# EAGLE schematic snarfbasev4a (EAGLE 6.4)
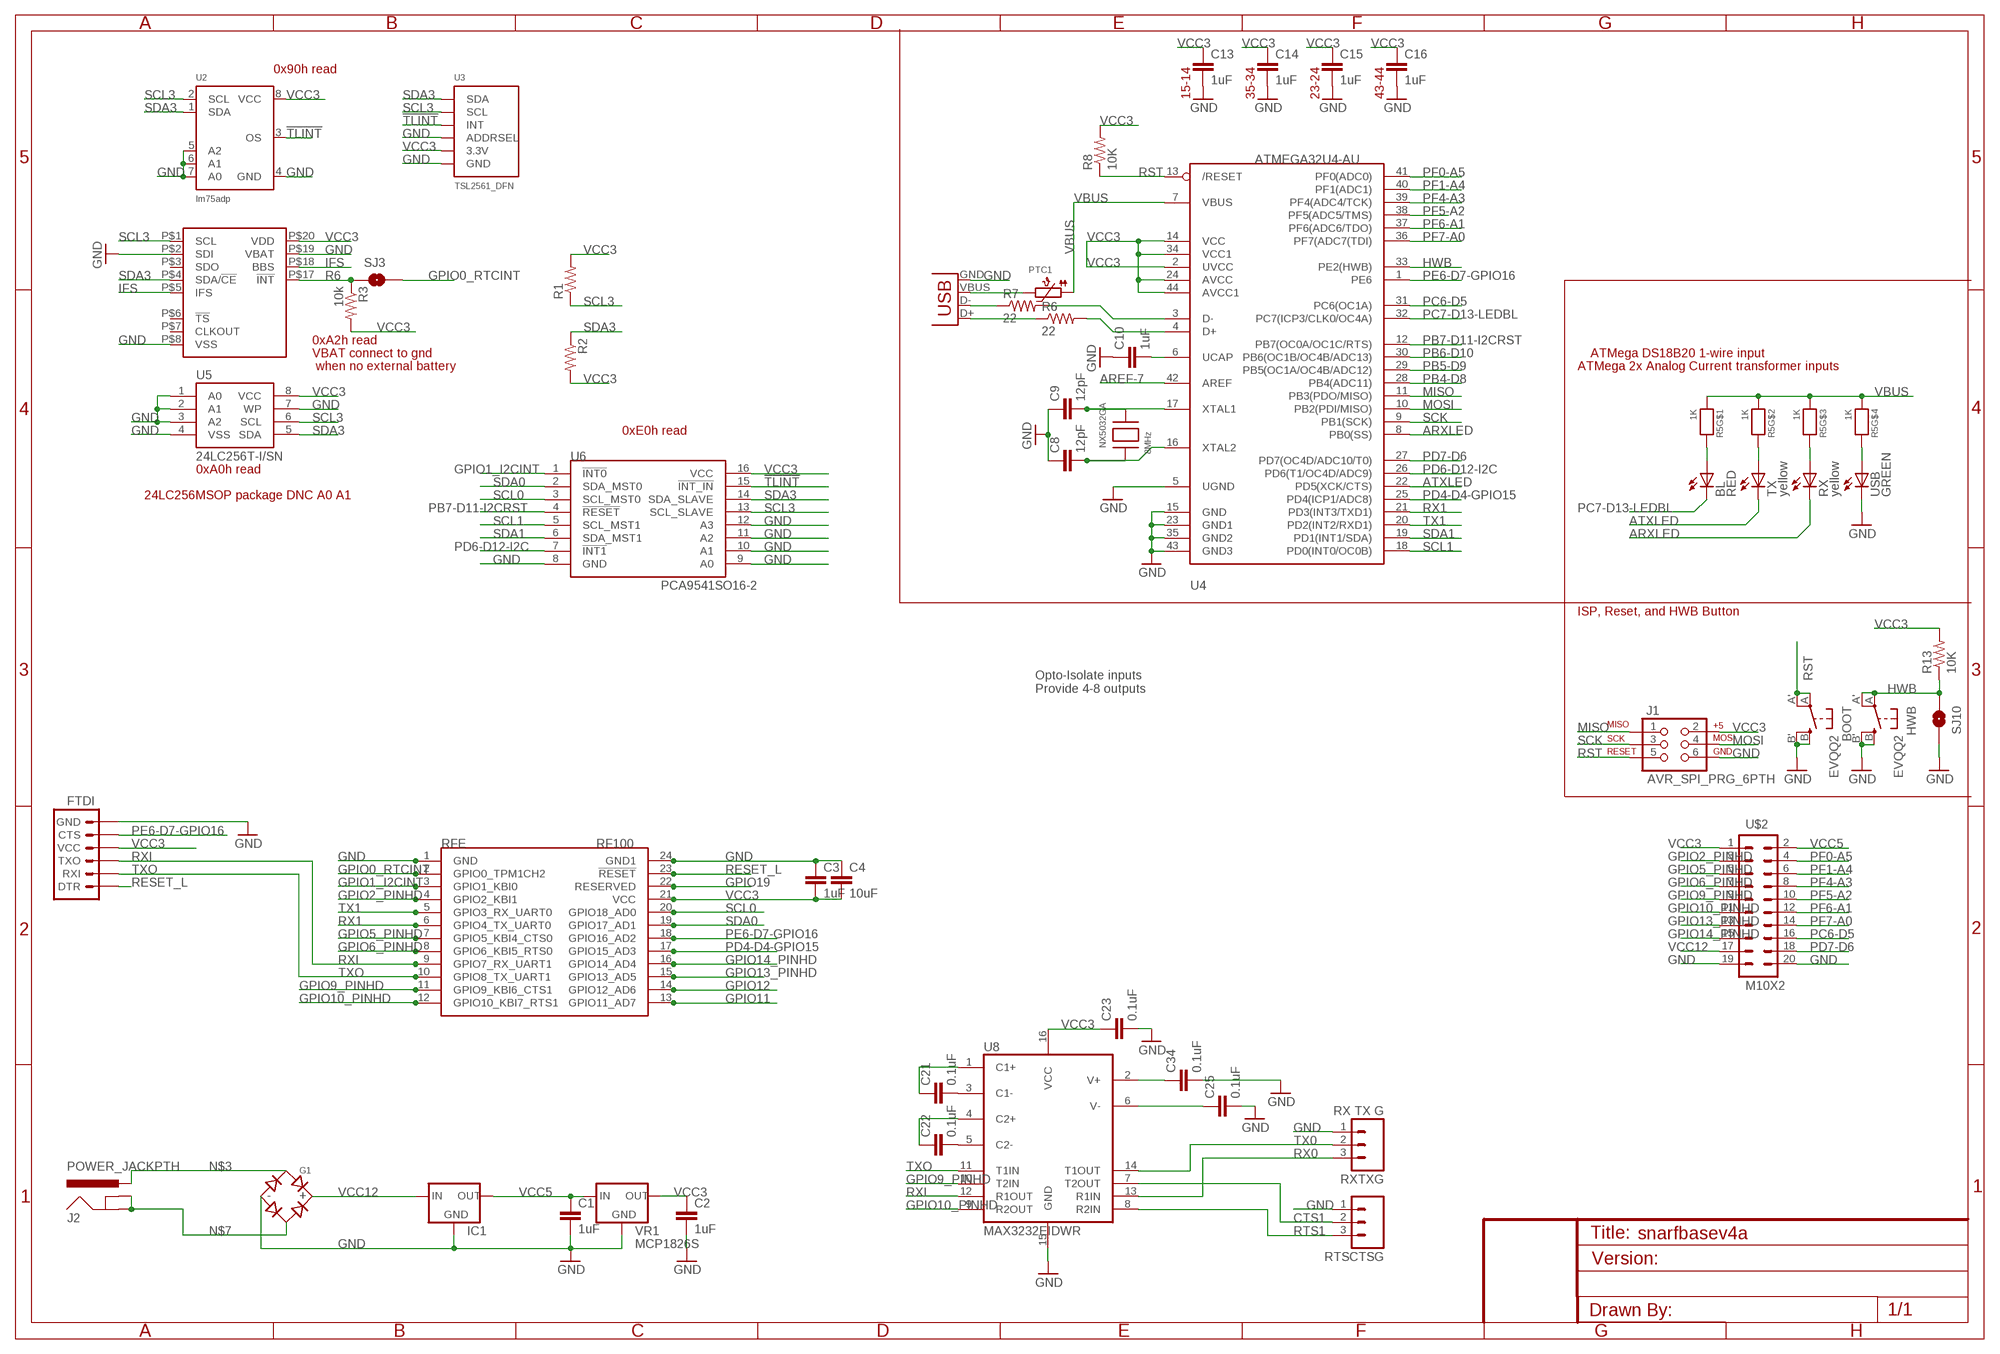
[diagram p0: schematic, sheet 1]

## Parts
BL  RED  LED0603  [LED-0603]
BOOT  EVQQ2  [EVQ-Q2]
C1  1uF  CAP0805  [0805]
C2  1uF  CAP0805  [0805]
C3  1uF  CAP0805  [0805]
C4  10uF  CAP0805  [0805]
C8  12pF  CAP0603-CAP  [0603-CAP]
C9  12pF  CAP0603-CAP  [0603-CAP]
C10  1uF  CAP0805  [0805]
C13  1uF  CAP0805  [0805]
C14  1uF  CAP0805  [0805]
C15  1uF  CAP0805  [0805]
C16  1uF  CAP0805  [0805]
C21  0.1uF  CAP0805  [0805]
C22  0.1uF  CAP0805  [0805]
C23  0.1uF  CAP0805  [0805]
C25  0.1uF  CAP0805  [0805]
C34  0.1uF  CAP0805  [0805]
FTDI  ARDUINO_SERIAL_PROGRAMPTH  [1X06]
G1  BRIDGERECTIFIER  [SOIC-4]
HWB  EVQQ2  [EVQ-Q2]
IC1  V_REG_78XXMURATA  [TO220-MURATA]
J1  AVR_SPI_PRG_6PTH  [2X3]
J2  POWER_JACKPTH  [POWER_JACK_PTH]
NX5032GA  8MHz  XTALNX5032  [NX5032]
PTC1  PTC1206  [1206]
R1  RESISTOR0805-RES  [0805]
R2  RESISTOR0805-RES  [0805]
R3  10k  RESISTOR  [0805]
R5  1K  RESISTOR_4PACK  [RESPACK_4X0603]
R6  22  RESISTOR0603-RES  [0603-RES]
R7  22  RESISTOR0603-RES  [0603-RES]
R8  10K  RESISTOR0805-RES  [0805]
R13  10K  RESISTOR0805-RES  [0805]
RFE  RFE  RF100-JACKJACK2  [SYNAPSERFENGINE-THM-SMT-JACK2]
RTSCTSG  M03PTH  [1X03]
RX  yellow  LED0603  [LED-0603]
RXTXG  RX TX G  M03PTH  [1X03]
SJ3  SOLDERJUMPERNC2  [SJ_2S-NOTRACE]
SJ10  HWB  SOLDERJUMPERNO  [SJ_2S-NO]
TX  yellow  LED0603  [LED-0603]
U1  PCF2129ASO20  [SO20W]
U2  lm75adp  TEMP_LM75B  [TSSOP8]
U3  TSL2561_DFN  LIGHT_TSL2561  [TSL2561_FN]
U4  ATMEGA32U4-AU  [TQFP44]
U5  24LC256T-I/SN  EEPROM-I2CSMD  [SO08]
U6  PCA9541SO16-2  [SOIC16]
U8  MAX3232EIDWR  MAX232SOIC16  [SO016]
U$2  M10X2  [2X10]
USB  GREEN  LED0603  [LED-0603]
VR1  MCP1826S  V_REG_MIC2920  [SOT223]
X1  USBSMD  USBH2959CT-ND  [USB-MINIB]

## Nets
!TLINT: U2.3(OS) U3.INT U6.15(!INT_IN)
AREF-7: U4.42(AREF)
ARXLED [smallsignal]: RX.C U4.8(PB0(SS))
ATXLED [smallsignal]: TX.C U4.22(PD5(XCK/CTS))
CTS1 [smallsignal]: RTSCTSG.2 U8.7(T2OUT)
GND: BOOT.B'(S1) BOOT.B(S) C1.2 C2.2 C3.1 C4.1 C8.1 C9.1 C10.1 C13.2 C14.2 C15.2 C16.2 C23.2 C25.2 C34.2 FTDI.6(GND) G1.- HWB.B'(S1) HWB.B(S) IC1.GND J1.6 RFE.1(GND) RFE.24(GND1) RFE.P1 RFE.P24 RFE.P201 RFE.P224 RTSCTSG.1 RXTXG.1 SJ10.2 U1.P$2(SDI) U1.P$8(VSS) U1.P$19(VBAT) U2.4(GND) U2.5(A2) U2.6(A1) U2.7(A0) U3.ADR(ADDRSEL) U3.VSS(GND) U4.5(UGND) U4.15(GND) U4.23(GND1) U4.35(GND2) U4.43(GND3) U5.1(A0) U5.2(A1) U5.3(A2) U5.4(VSS) U5.7(WP) U6.8(GND) U6.9(A0) U6.10(A1) U6.11(A2) U6.12(A3) U8.15(GND) U$2.19 U$2.20 USB.C VR1.2(GND) VR1.4(GND) X1.GND
GPIO0_RTCINT [smallsignal]: RFE.2(GPIO0_TPM1CH2) RFE.P2 RFE.P202 SJ3.2
GPIO1_I2CINT [smallsignal]: RFE.3(GPIO1_KBI0) RFE.P3 RFE.P203 U6.1(!INT0)
GPIO2_PINHD [smallsignal]: RFE.4(GPIO2_KBI1) RFE.P4 RFE.P204 U$2.3
GPIO5_PINHD [smallsignal]: RFE.7(GPIO5_KBI4_CTS0) RFE.P7 RFE.P207 U$2.5
GPIO6_PINHD [smallsignal]: RFE.8(GPIO6_KBI5_RTS0) RFE.P8 RFE.P208 U$2.7
GPIO9_PINHD: RFE.11(GPIO9_KBI6_CTS1) RFE.P11 RFE.P211 U8.10(T2IN) U$2.9
GPIO10_PINHD: RFE.12(GPIO10_KBI7_RTS1) RFE.P12 RFE.P212 U8.9(R2OUT) U$2.11
GPIO11 [smallsignal]: RFE.13(GPIO11_AD7) RFE.P13 RFE.P213
GPIO12 [smallsignal]: RFE.14(GPIO12_AD6) RFE.P14 RFE.P214
GPIO13_PINHD [smallsignal]: RFE.15(GPIO13_AD5) RFE.P15 RFE.P215 U$2.13
GPIO14_PINHD [smallsignal]: RFE.16(GPIO14_AD4) RFE.P16 RFE.P216 U$2.15
GPIO19: RFE.22(RESERVED) RFE.P22 RFE.P222
HWB [smallsignal]: HWB.A'(P1) HWB.A(P) R13.1 SJ10.1 U4.33(PE2(HWB))
IFS: U1.P$5(IFS) U1.P$18(BBS)
MISO [smallsignal]: J1.1 U4.11(PB3(PDO/MISO))
MOSI [smallsignal]: J1.4 U4.10(PB2(PDI/MISO))
N$3 [Power]: G1.~1(AC1) J2.PWR
N$4: C10.2 U4.6(UCAP)
N$5: BL.A R5.8
N$7 [Power]: G1.~2(AC2) J2.GND J2.GNDBREAK
N$8: R5.7 TX.A
N$9: R5.6 RX.A
N$10: R5.5 USB.A
N$13: C21.2 U8.3(C1-)
N$14: C22.2 U8.5(C2-)
N$15: C34.1 U8.2(V+)
N$16: C25.1 U8.6(V-)
N$17: C21.1 U8.1(C1+)
N$18: C22.1 U8.4(C2+)
PB4-D8 [smallsignal]: U4.28(PB4(ADC11))
PB5-D9 [smallsignal]: U4.29(PB5(OC1A/OC4B/ADC12))
PB6-D10 [smallsignal]: U4.30(PB6(OC1B/OC4B/ADC13))
PB7-D11-I2CRST [smallsignal]: U4.12(PB7(OC0A/OC1C/RTS)) U6.4(!RESET)
PC6-D5 [smallsignal]: U4.31(PC6(OC1A)) U$2.16
PC7-D13-LEDBL [smallsignal]: BL.C U4.32(PC7(ICP3/CLK0/OC4A))
PD4-D4-GPIO15 [smallsignal]: RFE.17(GPIO15_AD3) RFE.P17 RFE.P217 U4.25(PD4(ICP1/ADC8))
PD6-D12-I2C [smallsignal]: U4.26(PD6(T1/OC4D/ADC9)) U6.7(!INT1)
PD7-D6 [smallsignal]: U4.27(PD7(OC4D/ADC10/T0)) U$2.18
PE6-D7-GPIO16 [smallsignal]: FTDI.5(CTS) RFE.18(GPIO16_AD2) RFE.P18 RFE.P218 U4.1(PE6)
PF0-A5 [smallsignal]: U4.41(PF0(ADC0)) U$2.4
PF1-A4 [smallsignal]: U4.40(PF1(ADC1)) U$2.6
PF4-A3 [smallsignal]: U4.39(PF4(ADC4/TCK)) U$2.8
PF5-A2 [smallsignal]: U4.38(PF5(ADC5/TMS)) U$2.10
PF6-A1 [smallsignal]: U4.37(PF6(ADC6/TDO)) U$2.12
PF7-A0 [smallsignal]: U4.36(PF7(ADC7(TDI)) U$2.14
R6: R3.1 SJ3.1 U1.P$17(!INT)
RESET_L [smallsignal]: FTDI.1(DTR) RFE.23(!RESET) RFE.P23 RFE.P223
RST [smallsignal]: BOOT.A'(P1) BOOT.A(P) J1.5 R8.1 U4.13(/RESET)
RTS1 [smallsignal]: RTSCTSG.3 U8.8(R2IN)
RX0: RXTXG.3 U8.13(R1IN)
RX1 [smallsignal]: RFE.6(GPIO4_TX_UART0) RFE.P6 RFE.P206 U4.21(PD3(INT3/TXD1))
RXI [smallsignal]: FTDI.3(TXO) RFE.9(GPIO7_RX_UART1) RFE.P9 RFE.P209 U8.12(R1OUT)
SCK [smallsignal]: J1.3 U4.9(PB1(SCK))
SCL0: RFE.20(GPIO18_AD0) RFE.P20 RFE.P220 U6.3(SCL_MST0)
SCL1 [smallsignal]: U4.18(PD0(INT0/OC0B)) U6.5(SCL_MST1)
SCL3 [smallsignal]: R1.1 U1.P$1(SCL) U2.2(SCL) U3.CLK(SCL) U5.6(SCL) U6.13(SCL_SLAVE)
SDA0: RFE.19(GPIO17_AD1) RFE.P19 RFE.P219 U6.2(SDA_MST0)
SDA1 [smallsignal]: U4.19(PD1(INT1/SDA)) U6.6(SDA_MST1)
SDA3 [smallsignal]: R2.1 U1.P$4(SDA/!CE) U2.1(SDA) U3.DATA(SDA) U5.5(SDA) U6.14(SDA_SLAVE)
TX0: RXTXG.2 U8.14(T1OUT)
TX1 [smallsignal]: RFE.5(GPIO3_RX_UART0) RFE.P5 RFE.P205 U4.20(PD2(INT2/RXD1))
TXO [smallsignal]: FTDI.2(RXI) RFE.10(GPIO8_TX_UART1) RFE.P10 RFE.P210 U8.11(T1IN)
UD_N: R7.2 U4.3(D-)
UD_P: R6.2 U4.4(D+)
UDM_N: R7.1 X1.D-
UDM_P: R6.1 X1.D+
VBUS: PTC1.1 R5.1 R5.2 R5.3 R5.4 U4.7(VBUS)
VBUSRAW: PTC1.2 X1.VBUS
VCC3: C2.1 C3.2 C4.2 C13.1 C14.1 C15.1 C16.1 C23.1 FTDI.4(VCC) J1.2 R1.2 R2.2 R3.2 R8.2 R13.2 RFE.21(VCC) RFE.P21 RFE.P221 U1.P$20(VDD) U2.8(VCC) U3.VDD(3.3V) U4.2(UVCC) U4.14(VCC) U4.24(AVCC) U4.34(VCC1) U4.44(AVCC1) U5.8(VCC) U6.16(VCC) U8.16(VCC) U$2.1 VR1.3(OUT)
VCC5 [Power]: C1.1 IC1.OUT U$2.2 VR1.1(IN)
VCC12 [Power]: G1.+ IC1.IN U$2.17
XTAL_N [smallsignal]: C9.2 NX5032GA.P$2 U4.17(XTAL1)
XTAL_P [smallsignal]: C8.2 NX5032GA.P$1 U4.16(XTAL2)
Unconnected: U1.P$3(SDO) U1.P$6(!TS) U1.P$7(CLKOUT)

## Notes on the sheet
- 0x90h read
- 15-14 | 35-34 | 23-24 | 43-44
- 0xA2h read
- VBAT connect to gnd | ATMega DS18B20 1-wire input
- when no external battery | ATMega 2x Analog Current transformer inputs
- 0xE0h read
- 0xA0h read
- 24LC256MSOP package DNC A0 A1
- ISP, Reset, and HWB Button
- Opto-Isolate inputs
  Provide 4-8 outputs

## Library data of the parts
BL RX TX USB = 0_jc-custom:LED: LEDs Standard schematic elements and footprints for 5mm, 3mm, 1206, and 0603 sized LEDs. 5mm - Spark Fun Electronics SKU : COM-00529 (and others)
BOOT HWB = adaprog:EVQQ2
C1-C4 C10 C13-C16 C21-C23 C25 C34 = 0_jc-custom:CAP: Capacitor Standard 0603 ceramic capacitor, and 0.1" leaded capacitor.
C8 C9 = SparkFun:CAP: Capacitor Standard 0603 ceramic capacitor, and 0.1" leaded capacitor.
FTDI = SparkFun:ARDUINO_SERIAL_PROGRAM
G1 = microbuilder:BRIDGERECTIFIER: Bridge Rectifier SOIC-4: Comchip B4S-G - 400V 800mA, Peak Vf 1.1V (Digikey: 641-1334-1-ND)
IC1 = 0_jc-custom-eagle6:V_REG_78XX: Voltage Regulator Standard 7805 5V regulator. IGO (Input Ground Output). Spark Fun Electronics SKU : COM-00107
J1 = SparkFun:AVR_SPI_PRG_6: AVR ISP 6 Pin This is the reduced ISP connector for AVR programming. Common on Arduino. This footprint will take up less PCB space and can be used with a 10-pin to 6-pin adapter such as SKU: BOB-08508
J2 = SparkFun-Connectors:POWER_JACK: Power Jack This is the standard 5.5mm barrel jack for power. The PTH is the most common, proven, reliable, footprint. The Slot footprint only works if the mill layer is transmitted to the PCB fab house so be warned. Mating wall wart : TOL-00298 (and others); PROD_ID: PRT-00119
NX5032GA = adafruit:XTAL: Low cost SMT crystals, no capacitors included http://www.ladyada.net/library/eagle
PTC1 = microbuilder:PTC: PTC (Resettable Fuse) 1206 Package 250mA PTC (16V Max, Time-to-Trip: 0.08s) - Digikey: F2110CT-ND 1210 Package 100mA PTC (30V Max, Time-to-Trip: 0.6s) - Digikey: MF-USMF010-2CT-ND 1812 Package 750mA PTC (24V Max, Time-to-Trip: 0.2s) - Digikey: MF-MSMF075/24-2CT-ND
R1 R2 R8 R13 = SparkFun-Resistors:RESISTOR: Resistor
R3 = SparkFun:RESISTOR: Resistor
R5 = microbuilder:RESISTOR_4PACK: Resistor Packs (4 resistors) 4 x 0603 10K 1/16W - Digikey: YC164J-10KCT-ND
R6 R7 = 0_jc-custom:RESISTOR
RFE = 0_jc-custom:RF100-JACK
RTSCTSG RXTXG = SparkFun:M03: Header 3 Standard 3-pin 0.1" header. Use with straight break away headers (SKU : PRT-00116), right angle break away headers (PRT-00553), swiss pins (PRT-00743), machine pins (PRT-00117), and female headers (PRT-00115). Molex polarized connector foot print use with SKU : PRT-08232 with associated crimp pins and housings.
SJ3 SJ10 = SparkFun:SOLDERJUMPER: Solder Jumper Standard SMD solder jumper. Used to automate production. Two varients : Normally Open and Normally Closed are the same, but have different paste layers. NC will have a large amount of paste and should jumper during reflow.
U1 = 0_jc-custom:PCF2129A
U2 = microbuilder:TEMP_LM75B: LM75B I2C Temperature Sensor The I2C-based LM75B can measure temperature between -55 and 125°C in 0.125°C increments (11-bit resolution). Digikey: 568-4768-1-ND For a 1.8V compatible part, look at the following pin and SW compatible parts: DS75LV - Mouser: 700-DS75LVS, Digikey: (TSSOP8) DS75LVU+-ND (SOIC8) DS75LVS+-ND
U3 = microbuilder:LIGHT_TSL2561: TSL2561 Light-To-Digital Sensor Mouser Part Numbers: CS (obsolete): 856-TSL2561CS DFN (cheapest): 856-TSL2561FN
U4 = adafruit:ATMEGA32U4: http://www.ladyada.net/library/eagle
U5 = SparkFun:EEPROM-I2C
U6 = 0_jc-custom-eagle6:PCA9541
U8 = SparkFun:MAX232: RS232 Transceiver Very common IC. This is generically called 'MAX232', but works with the 3V equivalent MAX3232 generic ICs. Field tested and mother approved. Spark Fun Electronics SKU : COM-00316 (DIP) and COM-00589 (SMD)
U$2 = SparkFun-Connectors:M10X2: This was SPECIALLY designed to be used with our Graphic LCD Backpack. Be sure you want to use this! It is not only staggered on each line of header holes, but IT IS ALSO offset of the center point of the top and bottom lines by 5 mil. This causes the headers to lock into place on the "standard" footprint on the LCD screen. The extra squares on the tdocu layer are there simply to reference other pins (if you were to actually populate a longer header than ten long - this is what we do with the backpacks).
VR1 = SparkFun-PowerIC:V_REG_MIC2920: MIC2920A (http://www.micrel.com/_PDF/mic2920.pdf) - 400mA output LDO Regulator
X1 = 0_jc-custom:USB: USB Connectors Fully proven 670-1190-1-ND http://search.digikey.com/scripts/DkSearch/dksus.dll?Detail&name=670-1190-1-ND

## Net classes
0 default: width 0.254 mm
1 smallsignal: width 0.152 mm
2 Power: width 0.508 mm
3 medsignal: width 0.203 mm